# Altium schematic sheet CoreBoard.SchDoc: Core Board Simulador E5A/B1
size A4; Date: 01/07/12024; ApprovedBy: Laert Ferreira; Author: Deived Ado/Jonhann Steff.; CompanyName: Metro Rio; Engineer: Jonhann Steffanno; Organization: SENAI; Revision: REV01; SheetNumber: 1; SheetTotal: 10
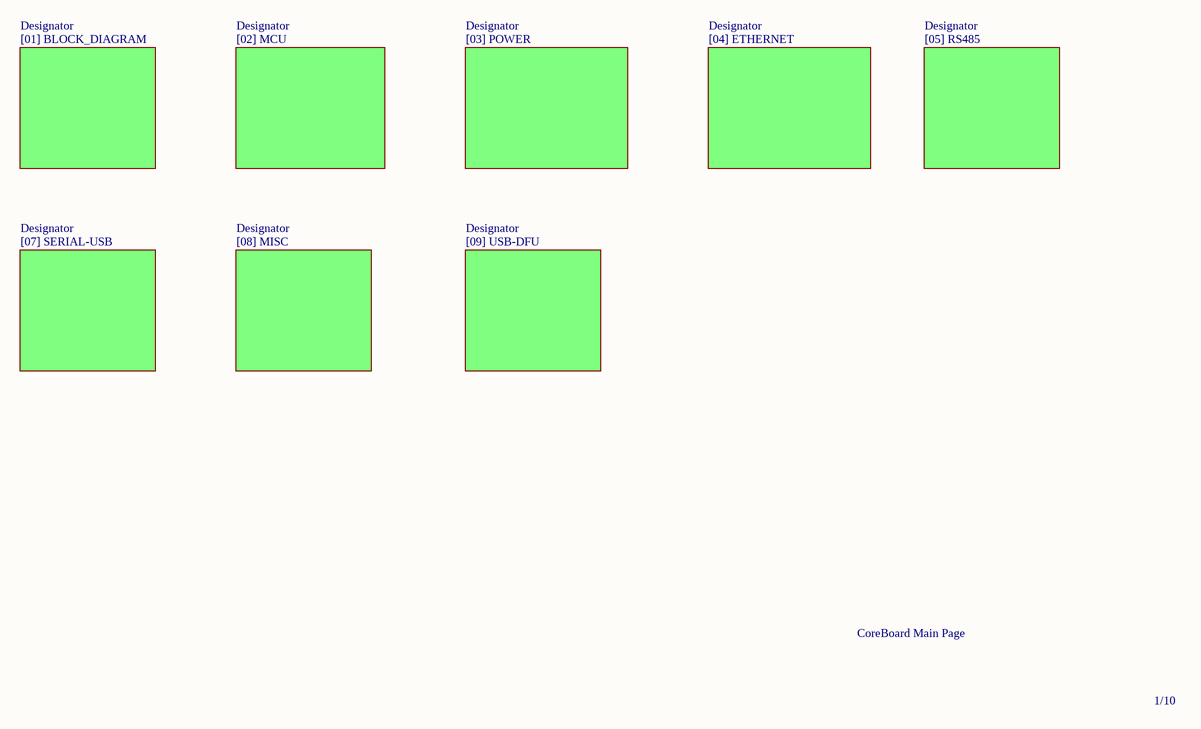
[diagram p0: CoreBoard.SchDoc]

## Sub-sheets
Designator = [01] BLOCK_DIAGRAM: no entries
Designator = [02] MCU: no entries
Designator = [03] POWER: no entries
Designator = [04] ETHERNET: no entries
Designator = [05] RS485: no entries
Designator = [07] SERIAL-USB: no entries
Designator = [08] MISC: no entries
Designator = [09] USB-DFU: no entries

## Notes on the sheet
- CoreBoard Main Page
- 1/10